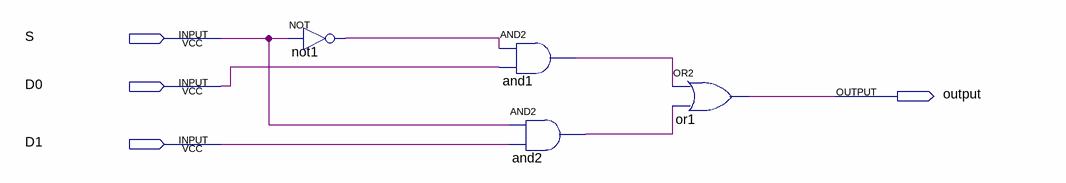
[diagram p0: schematic sheet]
// Quartus schematic 1_bit_selector.bdf as structural Verilog: 4 symbols, 4 pins
module \1_bit_selector  (
  input  S,
  input  D0,
  input  D1,
  output \output 
);

  wire and1_out, and2_out, not1_out;

  not not1 (not1_out, S);
  and and1 (and1_out, not1_out, D0);
  and and2 (and2_out, S, D1);
  or or1 (\output , and1_out, and2_out);
endmodule
